# EAGLE design alarme3 (EAGLE 4.11)
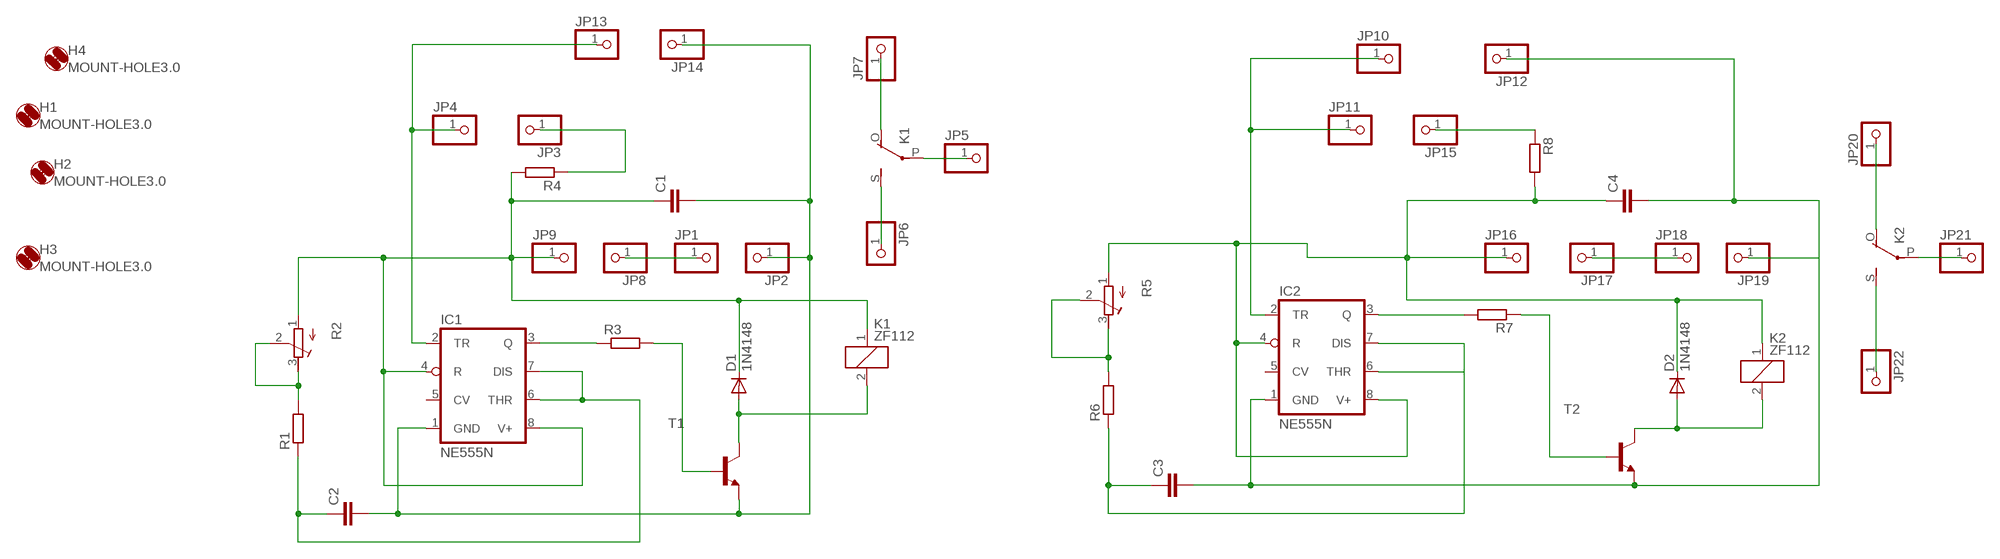
[diagram p0: schematic, sheet 1]

## Parts
C1  C-EU050-045X075  [C050-045X075]
C2  C-EU050-045X075  [C050-045X075]
C3  C-EU050-045X075  [C050-045X075]
C4  C-EU050-045X075  [C050-045X075]
D1  1N4148  [DO35-10]
D2  1N4148  [DO35-10]
H1  MOUNT-HOLE3.0  [3,0]
H2  MOUNT-HOLE3.0  [3,0]
H3  MOUNT-HOLE3.0  [3,0]
H4  MOUNT-HOLE3.0  [3,0]
IC1  NE555N  [DIL08]
IC2  NE555N  [DIL08]
JP1  PINHD-1X1  [1X01]
JP2  PINHD-1X1  [1X01]
JP3  PINHD-1X1  [1X01]
JP4  PINHD-1X1  [1X01]
JP5  PINHD-1X1  [1X01]
JP6  PINHD-1X1  [1X01]
JP7  PINHD-1X1  [1X01]
JP8  PINHD-1X1  [1X01]
JP9  PINHD-1X1  [1X01]
JP10  PINHD-1X1  [1X01]
JP11  PINHD-1X1  [1X01]
JP12  PINHD-1X1  [1X01]
JP13  PINHD-1X1  [1X01]
JP14  PINHD-1X1  [1X01]
JP15  PINHD-1X1  [1X01]
JP16  PINHD-1X1  [1X01]
JP17  PINHD-1X1  [1X01]
JP18  PINHD-1X1  [1X01]
JP19  PINHD-1X1  [1X01]
JP20  PINHD-1X1  [1X01]
JP21  PINHD-1X1  [1X01]
JP22  PINHD-1X1  [1X01]
K1  ZF112  [ZF112]
K2  ZF112  [ZF112]
R1  R-EU_0207/10  [0207/10]
R2  R-TRIMM3339P  [RTRIM3339P]
R3  R-EU_0207/10  [0207/10]
R4  R-EU_0207/10  [0207/10]
R5  R-TRIMM3339P  [RTRIM3339P]
R6  R-EU_0207/10  [0207/10]
R7  R-EU_0207/10  [0207/10]
R8  R-EU_0207/10  [0207/10]
T1  BC548A-NPN-TO92-EBC  [TO92-EBC]
T2  BC548A-NPN-TO92-EBC  [TO92-EBC]

## Nets
N$1: C1.1 D1.C IC1.4(R) IC1.8(V+) JP9.1 K1.1 R2.1(E) R4.2
N$2: C2.1 IC1.6(THR) IC1.7(DIS) R1.1
N$3: C1.2 C2.2 IC1.1(GND) JP2.1 JP14.1 T1.E
N$4: R1.2 R2.2(S) R2.3(A)
N$5: IC1.3(Q) R3.1
N$6: R3.2 T1.B
N$7: JP6.1 K1.S(2:S)
N$8: IC1.2(TR) JP4.1 JP13.1
N$21: R5.2(S) R5.3(A) R6.2
N$39: D1.A K1.2 T1.C
N$40: JP5.1 K1.P(2:P)
N$46: JP7.1 K1.O(2:O)
N$48: JP1.1 JP8.1
N$50: C3.1 IC2.6(THR) IC2.7(DIS) R6.1
N$51: JP3.1 R4.1
N$53: C3.2 C4.2 IC2.1(GND) JP12.1 JP19.1 T2.E
N$55: IC2.3(Q) R7.2
N$56: JP15.1 R8.1
N$59: IC2.2(TR) JP10.1 JP11.1
N$65: JP17.1 JP18.1
N$66: C4.1 D2.C IC2.4(R) IC2.8(V+) JP16.1 K2.1 R5.1(E) R8.2
N$69: D2.A K2.2 T2.C
N$70: R7.1 T2.B
N$73: JP20.1 K2.O(2:O)
N$74: JP21.1 K2.P(2:P)
N$75: JP22.1 K2.S(2:S)
Unconnected: IC1.5(CV) IC2.5(CV)

## Library data of the parts
C1-C4 = rcl:C-EU: CAPACITOR, European symbol
D1 D2 = diode:1N4148: DIODE high speed (Philips)
H1-H4 = holes:MOUNT-HOLE: MOUNTING HOLE with drill center marker
IC1 IC2 = linear:*555: TIMER
JP1-JP22 = pinhead:PINHD-1X1: PIN HEADER
K1 K2 = relay:ZF112: RELAY 1 x switch
R1 R3 R4 R6-R8 = rcl:R-EU_: RESISTOR, European symbol
R2 R5 = rcl:R-TRIMM: Trimm resistor
T1 T2 = transistor:*-NPN-: NPN Transistror

## Board
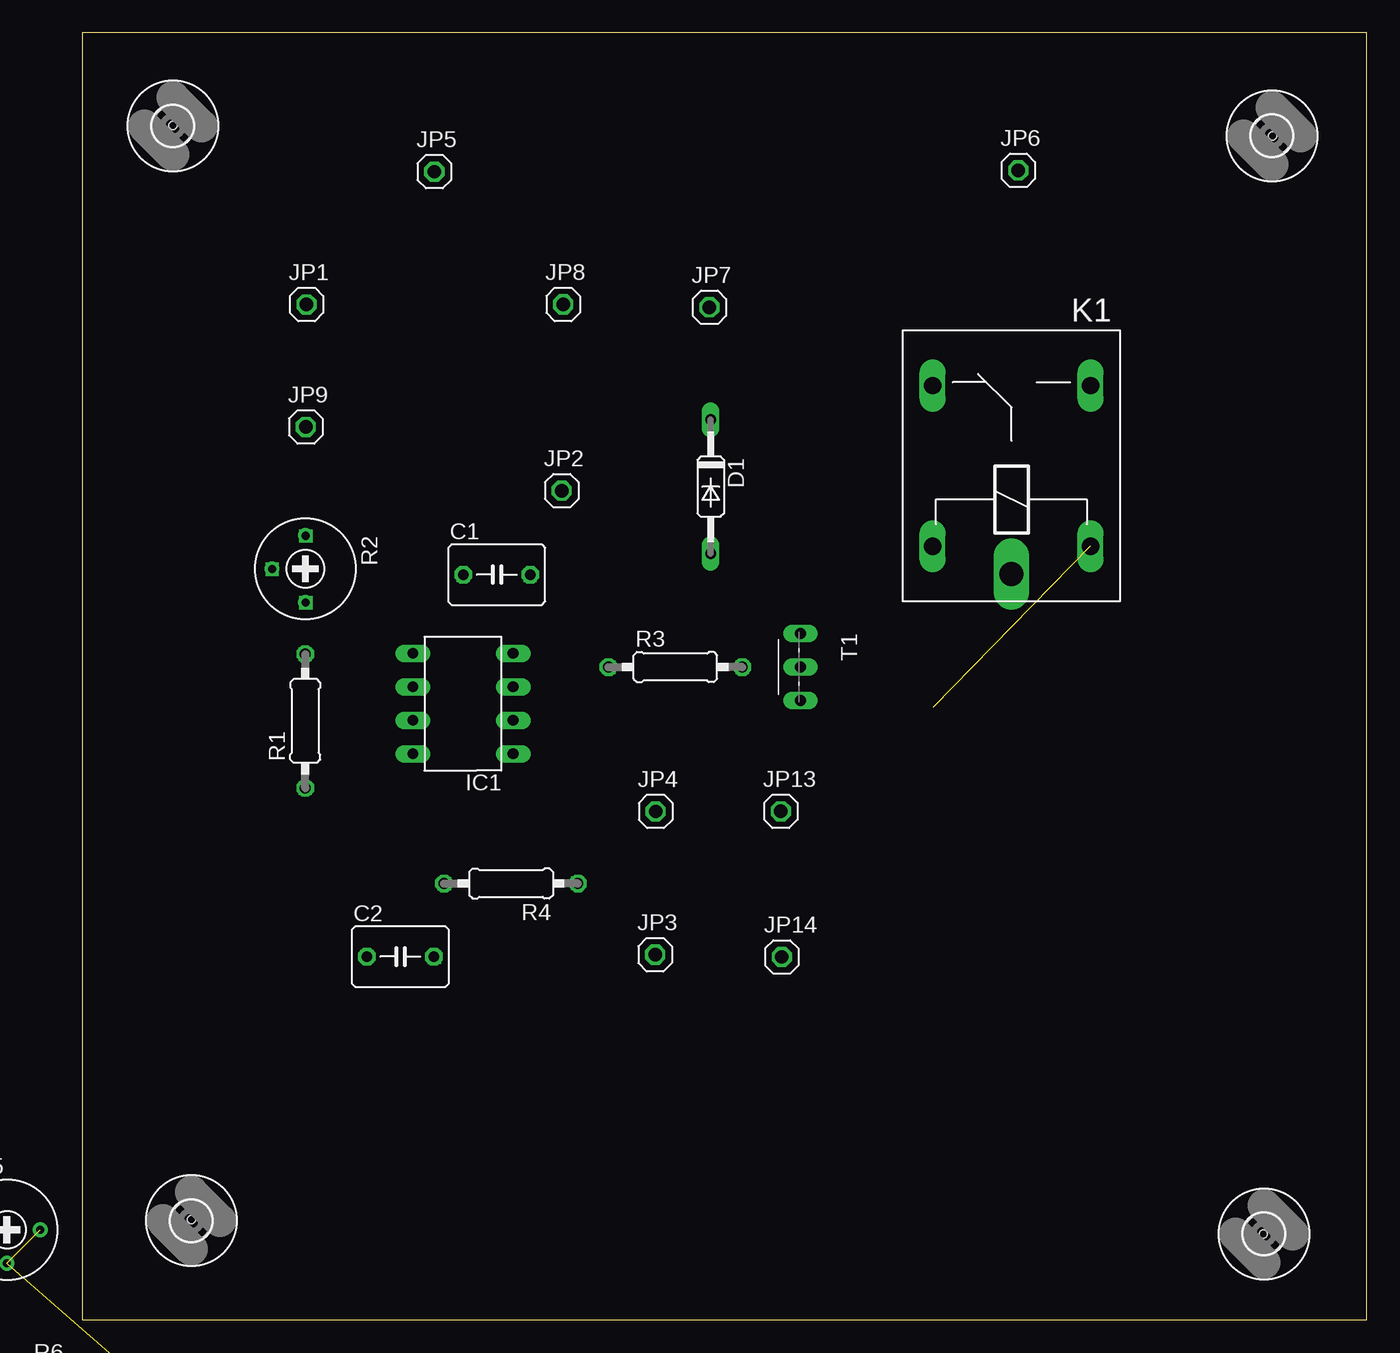
[diagram p1: board, top side]
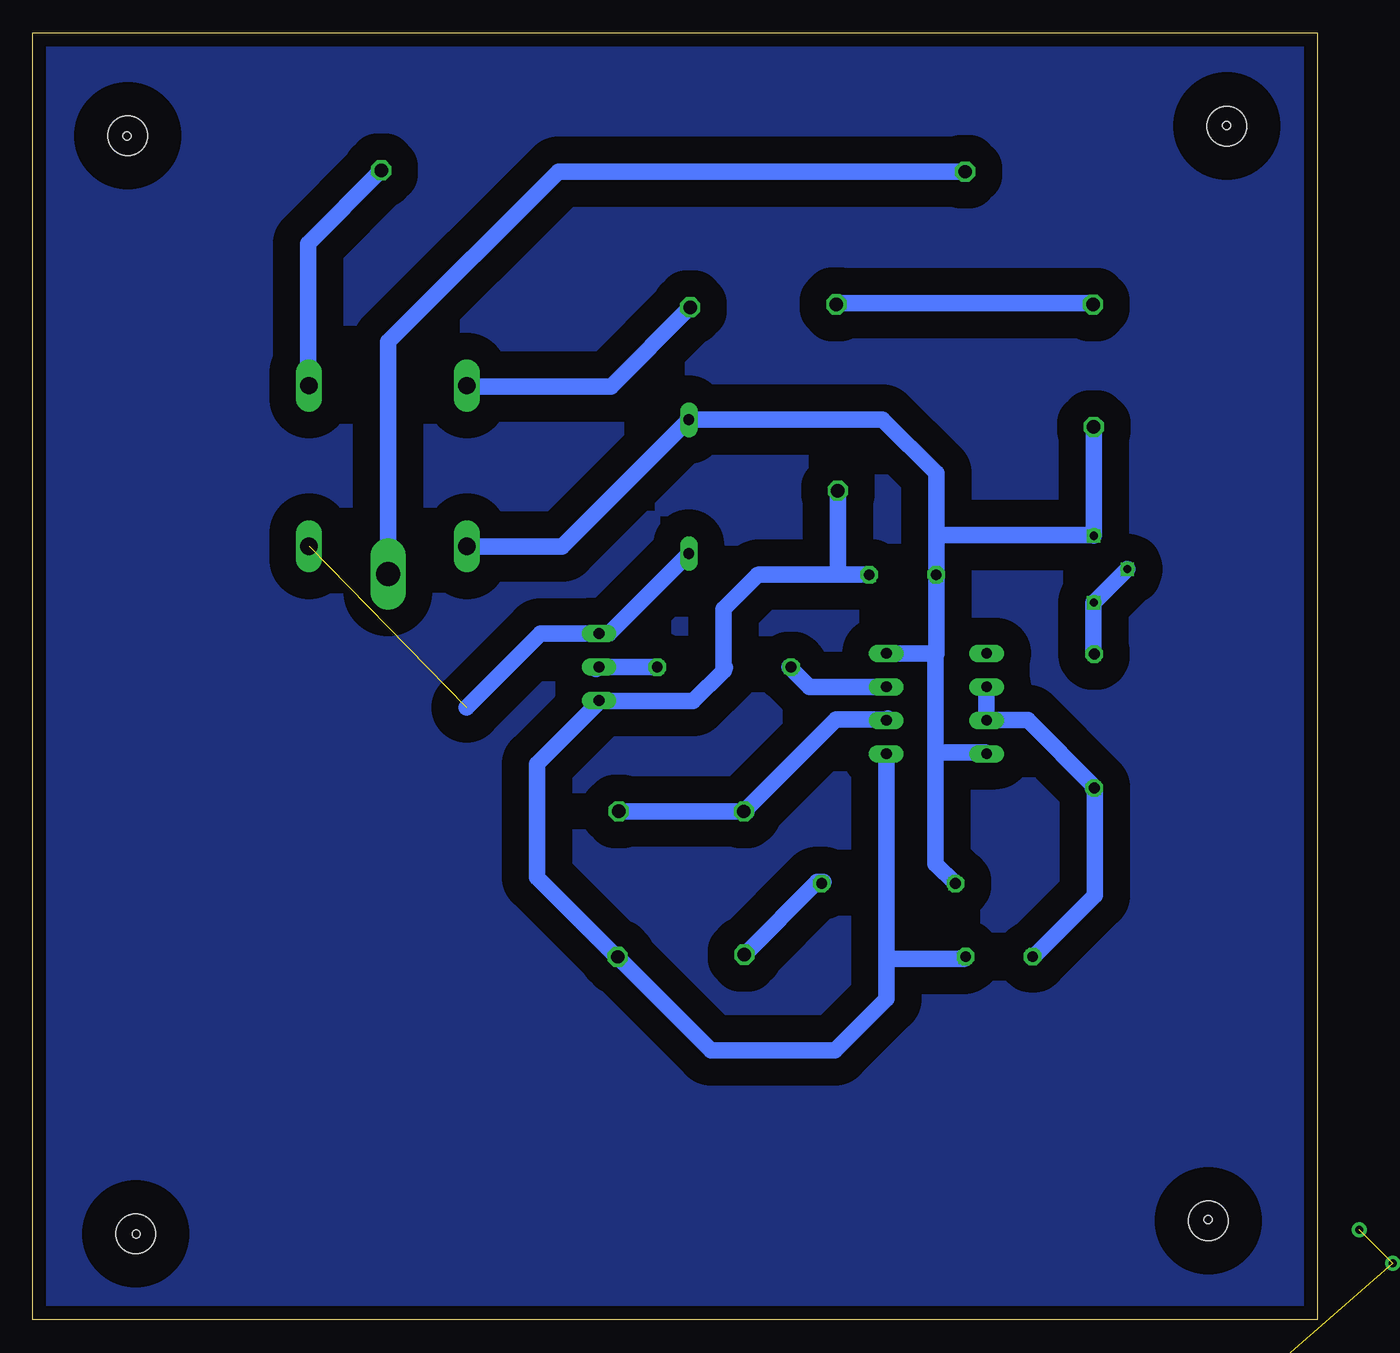
[diagram p2: board, bottom side, seen from below]

Size 97.46 x 97.64 mm. Coordinates in mm from the lower left corner, seen from the top.
Outline: 0,0 97.46,0 97.46,97.64 0,97.64 0,0
Copper layers 16: Bottom 0.035mm
Design rules "default": minimum track width 10mil, minimum drill 24mil, track to track 80mil, track to pad 80mil, pad to pad 80mil, via to via 80mil, smd to smd 80mil, copper to edge 40mil, drill to drill 8mil, minimum pad ring 10mil, minimum via ring 8mil, stop-mask expansion 4mil, vias tented up to drill 0mil, thermal gap 10mil
Holes 0.61 mm at 89.63,6.5 8.28,7.59 90.31,89.83 6.89,90.62

### Footprints (pad centres in the part's own frame; a part is rotated, then mirrored left to right if it is on the bottom)
C050-045X075 = drill 0.813 octagon: 1 -2.54,0; 2 2.54,0
DO35-10 = drill 0.813 long: A 5.08,0; C -5.08,0
3,0 = hole 3: 0,0
DIL08 = drill 0.813 long: 1 -3.81,-3.81; 2 -1.27,-3.81; 3 1.27,-3.81; 4 3.81,-3.81; 5 3.81,3.81; 6 1.27,3.81; 7 -1.27,3.81; 8 -3.81,3.81
1X01 = drill 1.016 octagon: 1 0,0
ZF112 = drill 1.321 long: 1 -6.096,5.994; 2 -6.096,-5.994; O 6.096,5.994; S 6.096,-5.994 | drill 1.803 long: P -8.204,0
0207/10 = drill 0.813 octagon: 1 -5.08,0; 2 5.08,0
RTRIM3339P = drill 0.61 round: 1 -2.54,0; 2 0,-2.54; 3 2.54,0
TO92-EBC = drill 0.813 long: B 0,-1.27; C -2.54,-1.27; E 2.54,-1.27

### Placement (x,y rotation side)
C1  31.45,56.53 0 top
C2  24.14,27.55 0 top
C3  -3.18,-13.5 0 top  (outside the outline)
C4  -3.18,-82.08 0 top  (outside the outline)
D1  47.69,63.21 270 top
D2  -0.64,-134.15 0 top  (outside the outline)
H1  89.66,6.51 0 top
H2  6.87,90.58 0 top
H3  8.28,7.51 0 top
H4  90.27,89.83 0 top
IC1  28.89,46.75 90 top
IC2  0.63,-28.74 0 top  (outside the outline)
JP1  17.02,77.03 0 top
JP2  36.39,62.91 0 top
JP3  43.47,27.7 0 top
JP4  43.51,38.57 0 top
JP5  26.72,87.11 0 top
JP6  71.03,87.21 0 top
JP7  47.59,76.82 0 top
JP8  36.49,77.04 0 top
JP9  16.97,67.74 0 top
JP10  -5.72,-42.71 0 top  (outside the outline)
JP11  -5.72,-50.33 0 top  (outside the outline)
JP12  -5.72,-57.95 0 top  (outside the outline)
JP13  53.01,38.58 0 top
JP14  53.09,27.52 0 top
JP15  -5.72,-65.57 0 top  (outside the outline)
JP16  -5.72,-90.97 0 top  (outside the outline)
JP17  -5.72,-98.59 0 top  (outside the outline)
JP18  -5.72,-106.21 0 top  (outside the outline)
JP19  -5.72,-113.83 0 top  (outside the outline)
JP20  -5.72,-169.71 0 top  (outside the outline)
JP21  -5.72,-177.33 0 top  (outside the outline)
JP22  -5.72,-184.95 0 top  (outside the outline)
K1  70.51,64.78 90 top
K2  1.9,-148.12 0 top  (outside the outline)
R1  16.92,45.43 90 top
R2  16.94,56.98 270 top
R3  45.01,49.52 0 top
R4  32.53,33.1 180 top
R5  -5.72,6.82 0 top  (outside the outline)
R6  -0.64,-4.61 0 top  (outside the outline)
R7  -0.64,-73.19 0 top  (outside the outline)
R8  -0.64,-162.09 0 top  (outside the outline)
T1  55.77,49.53 270 top
T2  -0.64,-122.72 0 top  (outside the outline)

### Tracks (layer width: path | path; a pad name or v marks a point on that pad's centre or on a via)
N$1
  Bottom 1.27: K1.1 64.5,58.67 64.5,58.66 57.32,58.66 D1.C 47.79,68.29 47.8,68.3 32.99,68.3 28.91,64.23 28.91,59.57 | 16.97,59.55 R2.1 | JP9.1 16.97,59.55 | 28.91,59.57 C1.1 28.91,50.49 28.95,50.49 28.95,50.5 | 28.91,59.57 28.82,59.57 28.79,59.55 16.97,59.55 | IC1.4 29.01,50.56 28.95,50.5 | 28.95,50.5 28.96,50.49 28.96,43.03 | R4.2 28.96,34.6 28.96,43.03 | IC1.8 25.17,43.03 28.96,43.03
N$2
  Bottom 1.27: R1.1 16.98,40.29 | IC1.6 25.09,48.01 25.09,45.5 | 25.09,45.5 IC1.7 | 16.98,40.29 17.02,40.32 | R1.1 16.87,40.4 21.97,45.5 25.09,45.5 | R1.1 | 16.98,40.29 16.96,40.26 | R1.1 16.87,40.3 16.87,32.18 21.57,27.48 21.6,27.51 C2.1
N$3
  Bottom 1.27: 45.06,49.36 44.95,49.47 | 45.06,49.36 | 45.06,49.36 | 45.06,49.36 45.06,53.92 42.46,56.52 42.38,56.52 42.37,56.53 36.37,56.53 | 36.37,56.53 C1.2 | 36.37,56.53 36.37,56.57 36.39,56.59 JP2.1 | IC1.1 | 54.44,46.93 T1.E | 54.44,46.93 59.2,42.17 59.2,33.56 53.12,27.48 53.12,27.49 JP14.1 46.01,20.45 36.61,20.45 32.7,24.36 32.7,27.39 | IC1.1 32.7,27.39 | IC1.1 | C2.2 26.83,27.39 32.7,27.39 | 45.06,49.36 45.06,49.3 45.04,49.28 47.38,46.93 54.44,46.93
N$4
  Bottom 1.27: R2.3 16.98,54.44 16.98,54.36 | R1.2 16.98,50.51 16.98,54.36 | R2.2 16.98,54.39 16.98,54.36
N$5  (via drill 0.61)
  Bottom 1.27: 40.04,49.52 40.05,49.53 | 40.04,49.52 v39.95,49.52 R3.1 | IC1.3 38.54,48.02 40.04,49.52
N$6  (via drill 0.61)
  Bottom 1.27: 54.61,49.52 54.6,49.53 T1.B | R3.2 v50.1,49.52 v54.49,49.52 54.61,49.52 | 54.61,49.52 54.75,49.38
N$7
  Bottom 1.27: K1.S 76.57,70.82 76.58,70.82 76.58,81.66 JP6.1
N$8
  Bottom 1.27: 32.59,45.61 32.59,45.58 IC1.2 32.77,45.54 36.53,45.54 JP4.1 43.36,38.57 | 43.36,38.57 43.3,38.51 | JP13.1 43.37,38.58 43.36,38.57
N$9
  pour Bottom: 0.63,0.47 0.72,97.05 96.86,97.05 96.77,0.47
N$10  (via drill 0.61)
  other vias: 36.5,77.07
N$11  (via drill 0.61)
  other vias: 47.68,68.3
N$12  (via drill 0.61)
  other vias: 47.62,76.81
N$13  (via drill 0.61)
  other vias: 36.39,62.89
N$14  (via drill 0.61)
  other vias: 33.98,56.49
N$15  (via drill 0.61)
  other vias: 47.77,58.14
N$16  (via drill 0.61)
  other vias: 17,67.69
N$17  (via drill 0.61)
  other vias: 54.54,52.07
N$18  (via drill 0.61)
  other vias: 16.96,59.46
N$19  (via drill 0.61)
  other vias: 28.9,56.49
N$20  (via drill 0.61)
  other vias: 32.69,50.53
N$21  (2 unrouted)
N$22  (via drill 0.61)
  other vias: 16.96,54.4
N$23  (via drill 0.61)
  other vias: 16.92,50.49
N$24  (via drill 0.61)
  other vias: 25.09,47.98
N$25  (via drill 0.61)
  other vias: 32.69,48.03
N$26  (via drill 0.61)
  other vias: 32.69,45.43
N$27  (via drill 0.61)
  other vias: 32.74,42.88
N$28  (via drill 0.61)
  other vias: 25.09,42.93
N$29  (via drill 0.61)
  other vias: 25.09,45.43
N$30  (via drill 0.61)
  other vias: 43.54,38.55
N$31  (via drill 0.61)
  other vias: 16.92,40.33
N$32  (via drill 0.61)
  other vias: 21.61,27.57
N$33  (via drill 0.61)
  other vias: 53.01,38.55
N$34  (via drill 0.61)
  other vias: 54.49,46.97
N$36  (via drill 0.61)
  other vias: 53.09,27.57
N$37  (via drill 0.61)
  other vias: 43.45,27.7
N$38  (via drill 0.61)
  other vias: 14.41,56.95
N$39  (1 unrouted)
  Bottom 1.27: T1.C 54.57,52.07 | T1.C 54.51,52.06 58.94,52.06 64.54,46.46 | D1.A 53.75,52.07 T1.C
N$40
  Bottom 1.27: JP5.1 57.59,87.11 70.5,74.2 70.5,56.83 70.67,56.66 70.59,56.58 K1.P
N$41  (via drill 0.61)
  other vias: 17.05,77.07
N$42  (via drill 0.61)
  other vias: 26.73,87.14
N$43  (via drill 0.61)
  other vias: 71.03,87.23
N$44  (via drill 0.61)
  other vias: 37.59,33.12
N$45  (via drill 0.61)
  other vias: 26.73,27.52
N$46
  Bottom 1.27: K1.O 64.5,70.86 64.5,70.82 53.59,70.82 JP7.1
N$47  (via drill 0.61)
  other vias: 27.47,33.08
N$48
  Bottom 1.27: JP8.1 36.61,77.15 36.61,77.16 17.14,77.16 JP1.1
N$50  (3 unrouted)
N$51
  Bottom 1.27: 37.5,33.21 37.48,33.21 | R4.1 37.5,33.21 | JP3.1 37.96,33.21 37.5,33.21
N$52  (via drill 0.61)
  other vias: 25.12,50.58
N$53  (5 unrouted)
N$55  (1 unrouted)
N$56  (1 unrouted)
N$59  (2 unrouted)
N$60  (via drill 0.61)
  other vias: 64.56,58.7
N$61  (via drill 0.61)
  other vias: 70.55,56.62
N$62  (via drill 0.61)
  other vias: 76.55,58.66
N$63  (via drill 0.61)
  other vias: 76.55,70.86
N$64  (via drill 0.61)
  other vias: 64.52,70.86
N$65  (1 unrouted)
N$66  (7 unrouted)
N$69  (2 unrouted)
N$70  (1 unrouted)
N$73  (1 unrouted)
N$74  (1 unrouted)
N$75  (1 unrouted)